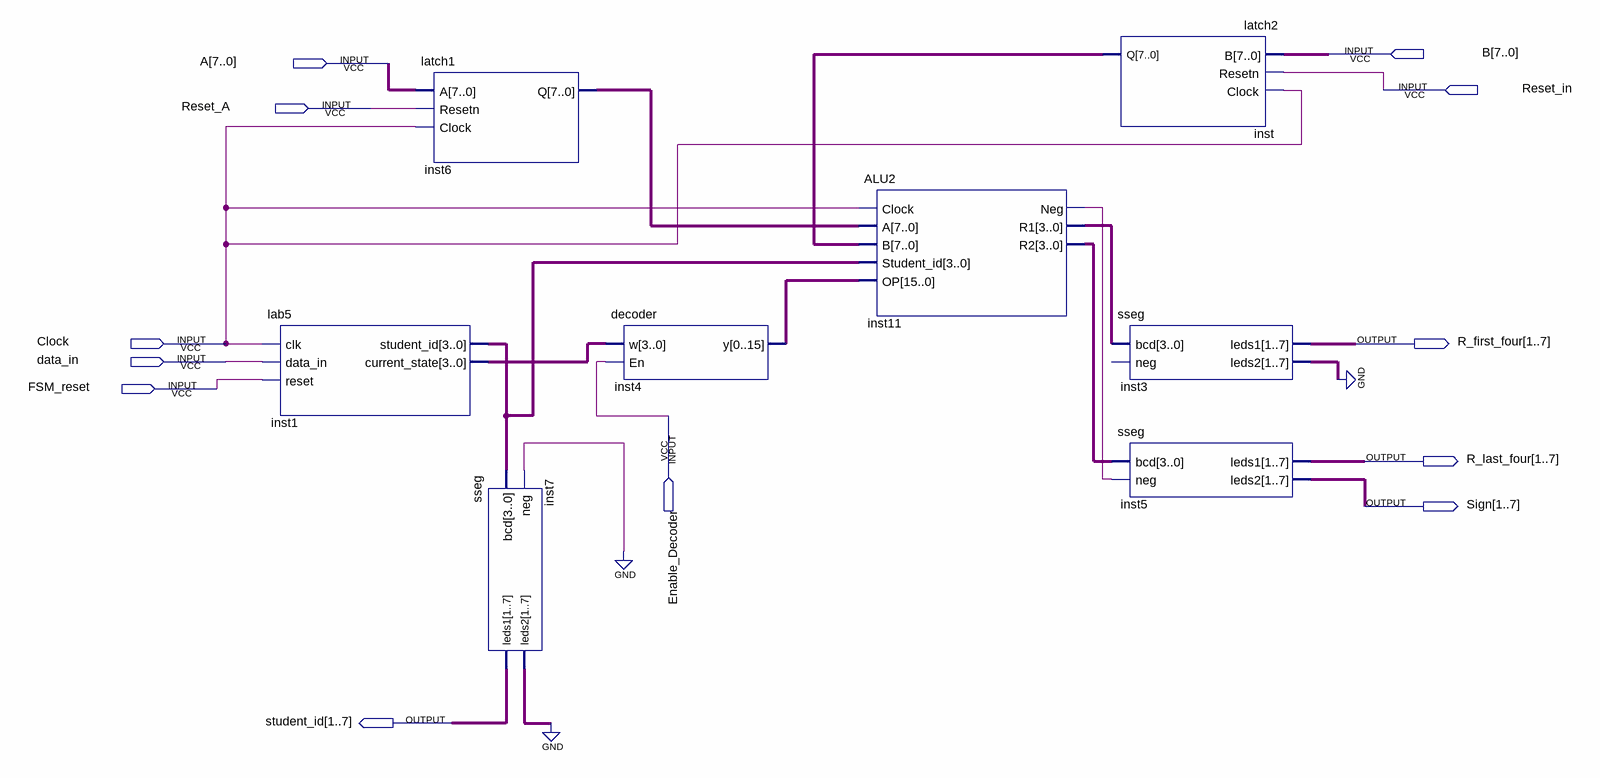
[diagram p0: schematic sheet]
// Quartus schematic ALU_P2.bdf as structural Verilog: 8 symbols, 12 pins
module ALU_P2 (
  input  [7:0] B,
  input  [7:0] A,
  input  Reset_in,
  input  Reset_A,
  input  Clock,
  input  data_in,
  input  FSM_reset,
  input  Enable_Decoder,
  output [1:7] R_first_four,
  output [1:7] R_last_four,
  output [1:7] Sign,
  output [1:7] student_id
);

  wire inst11_neg;
  wire [3:0] inst1_current_state, inst1_student_id, inst11_r1, inst11_r2;
  wire [6:0] inst3_leds2, inst7_leds2;
  wire [7:0] inst6_q, inst_q;
  wire [15:0] inst4_y;

  lab5 inst1 (
    .clk(Clock), .data_in(data_in), .reset(FSM_reset), .student_id(inst1_student_id),
    .current_state(inst1_current_state));
  latch1 inst6 (.A(A), .Resetn(Reset_A), .Clock(Clock), .Q(inst6_q));
  sseg inst7 (.bcd(inst1_student_id), .neg(1'b0), .leds1(student_id), .leds2(inst7_leds2));
  decoder inst4 (.w(inst1_current_state), .En(Enable_Decoder), .y(inst4_y));
  ALU2 inst11 (
    .Clock(Clock), .A(inst6_q), .B(inst_q), .Student_id(inst1_student_id), .OP(inst4_y), .Neg(inst11_neg),
    .R1(inst11_r1), .R2(inst11_r2));
  latch2 inst (.B(B), .Resetn(Reset_in), .Clock(Clock), .Q(inst_q));
  sseg inst3 (.bcd(inst11_r1), .leds1(R_first_four), .leds2(inst3_leds2));  // open: neg
  sseg inst5 (.bcd(inst11_r2), .neg(inst11_neg), .leds1(R_last_four), .leds2(Sign));
  // also tied to GND on the sheet: {inst3_leds2[0], inst3_leds2[1], inst3_leds2[2], inst3_leds2[3], inst3_leds2[4], inst3_leds2[5], inst3_leds2[6], inst7_leds2[0], inst7_leds2[1], inst7_leds2[2], inst7_leds2[3], inst7_leds2[4], inst7_leds2[5], inst7_leds2[6]}
endmodule
